# EAGLE design anemo4 (EAGLE 6.6.0)
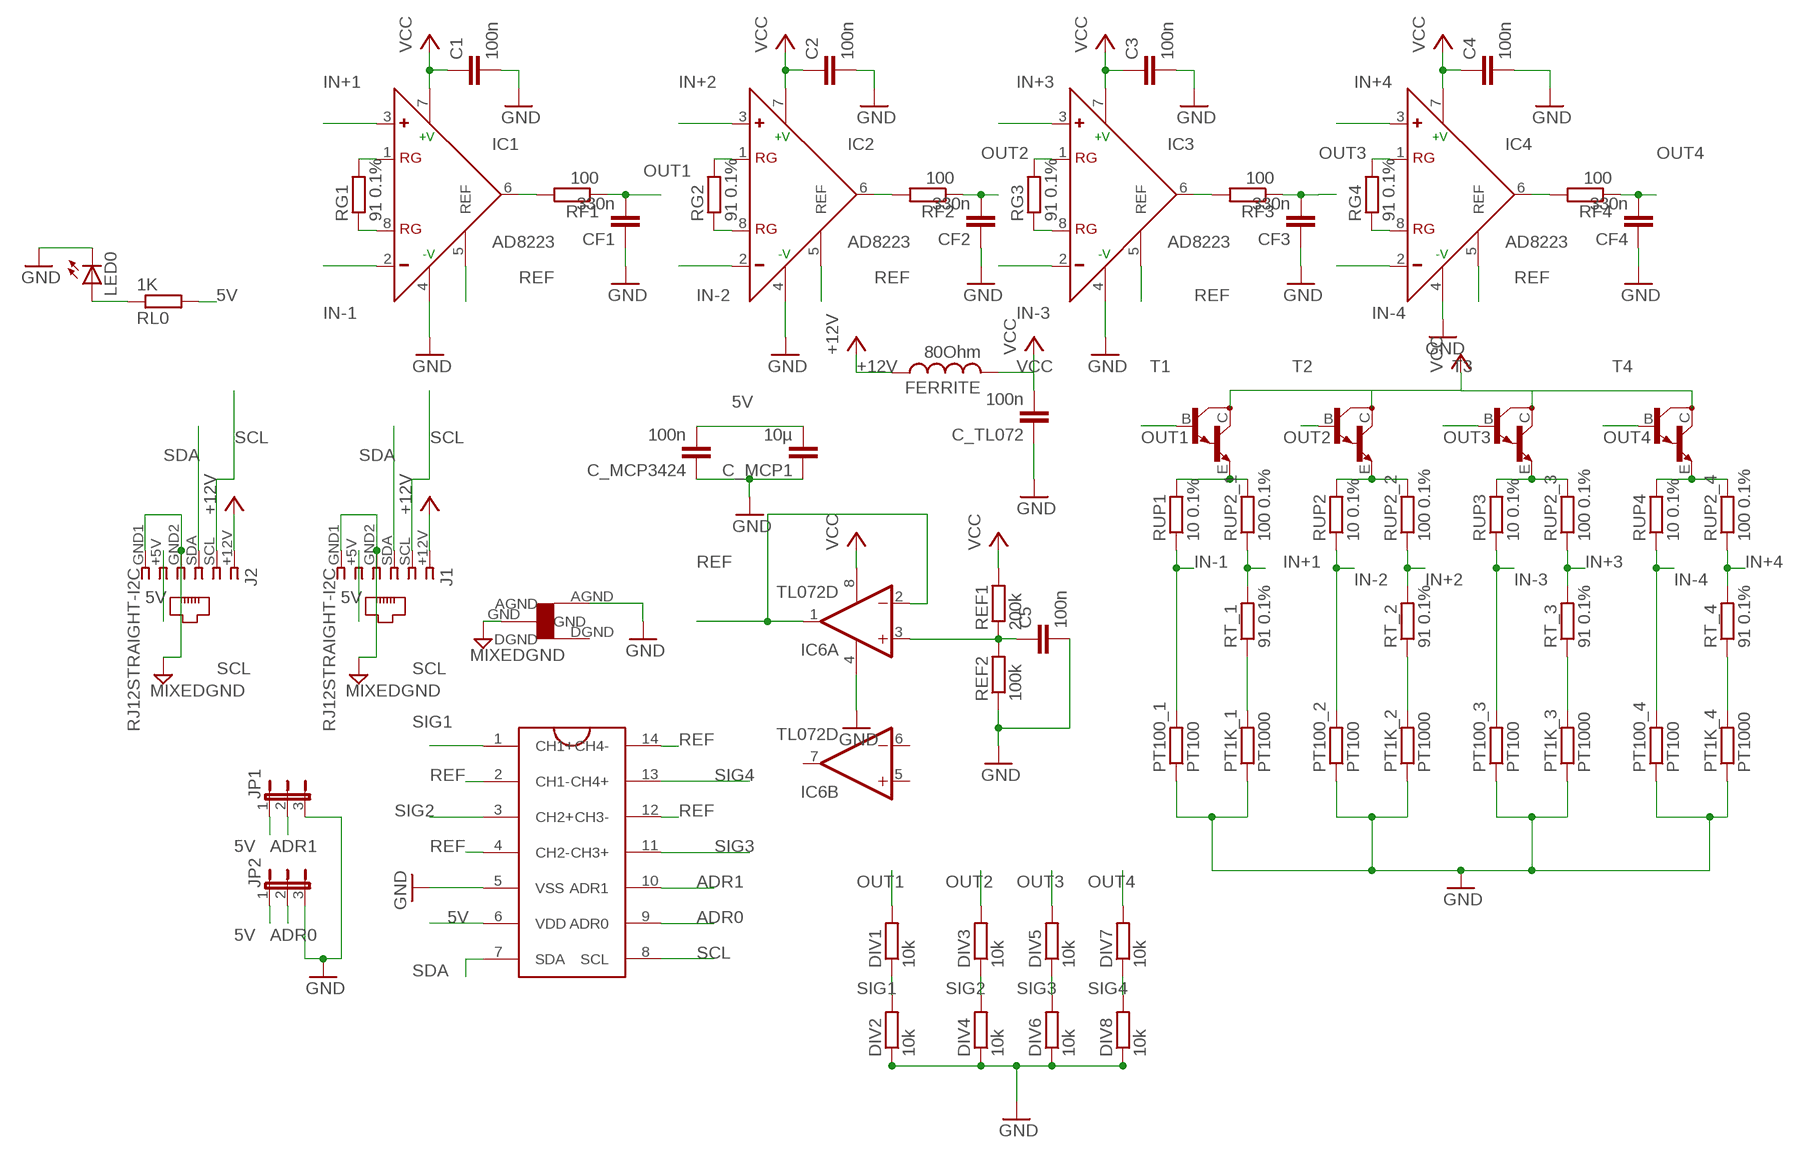
[diagram p0: schematic, sheet 1]

## Parts
C1  100n  C-EUC1206  [C1206]
C2  100n  C-EUC1206  [C1206]
C3  100n  C-EUC1206  [C1206]
C4  100n  C-EUC1206  [C1206]
C5  100n  C-EUC1206  [C1206]
C_MCP1  10µ  C-EUC1206  [C1206]
C_MCP3424  100n  C-EUC1206  [C1206]
C_TL072  100n  C-EUC1206  [C1206]
CF1  330n  C-EUC1206  [C1206]
CF2  330n  C-EUC1206  [C1206]
CF3  330n  C-EUC1206  [C1206]
CF4  330n  C-EUC1206  [C1206]
DIV1  10k  R-EU_M1206  [M1206]
DIV2  10k  R-EU_M1206  [M1206]
DIV3  10k  R-EU_M1206  [M1206]
DIV4  10k  R-EU_M1206  [M1206]
DIV5  10k  R-EU_M1206  [M1206]
DIV6  10k  R-EU_M1206  [M1206]
DIV7  10k  R-EU_M1206  [M1206]
DIV8  10k  R-EU_M1206  [M1206]
FERRITE  80Ohm  L-USL3216C  [L3216C]
IC1  AD8223  AD620R  [SO8]
IC2  AD8223  AD620R  [SO8]
IC3  AD8223  AD620R  [SO8]
IC4  AD8223  AD620R  [SO8]
IC6  TL072D  [SO08]
J1  RJ12STRAIGHT-I2C  [RJ12-STRAIGHT-I2C]
J2  RJ12STRAIGHT-I2C  [RJ12-STRAIGHT-I2C]
JP1  JP2E  [JP2]
JP2  JP2E  [JP2]
LED0  LED1206  [LED-1206]
PT1K_1  PT1000  R-EU_M1206  [M1206]
PT1K_2  PT1000  R-EU_M1206  [M1206]
PT1K_3  PT1000  R-EU_M1206  [M1206]
PT1K_4  PT1000  R-EU_M1206  [M1206]
PT100_1  PT100  R-EU_M1206  [M1206]
PT100_2  PT100  R-EU_M1206  [M1206]
PT100_3  PT100  R-EU_M1206  [M1206]
PT100_4  PT100  R-EU_M1206  [M1206]
REF1  200k  R-EU_M1206  [M1206]
REF2  100k  R-EU_M1206  [M1206]
RF1  100  R-EU_M1206  [M1206]
RF2  100  R-EU_M1206  [M1206]
RF3  100  R-EU_M1206  [M1206]
RF4  100  R-EU_M1206  [M1206]
RG1  91 0.1%  R-EU_M1206  [M1206]
RG2  91 0.1%  R-EU_M1206  [M1206]
RG3  91 0.1%  R-EU_M1206  [M1206]
RG4  91 0.1%  R-EU_M1206  [M1206]
RL0  1K  R-EU_M1206  [M1206]
RT_1  91 0.1%  R-EU_M1206  [M1206]
RT_2  91 0.1%  R-EU_M1206  [M1206]
RT_3  91 0.1%  R-EU_M1206  [M1206]
RT_4  91 0.1%  R-EU_M1206  [M1206]
RUP1  10 0.1%  R-EU_M1206  [M1206]
RUP2  10 0.1%  R-EU_M1206  [M1206]
RUP2_1  100 0.1%  R-EU_M1206  [M1206]
RUP2_2  100 0.1%  R-EU_M1206  [M1206]
RUP2_3  100 0.1%  R-EU_M1206  [M1206]
RUP2_4  100 0.1%  R-EU_M1206  [M1206]
RUP3  10 0.1%  R-EU_M1206  [M1206]
RUP4  10 0.1%  R-EU_M1206  [M1206]
T1  MMBTA13LT1-NPN_DARL-SOT23-BEC  [SOT23-BEC]
T2  MMBTA13LT1-NPN_DARL-SOT23-BEC  [SOT23-BEC]
T3  MMBTA13LT1-NPN_DARL-SOT23-BEC  [SOT23-BEC]
T4  MMBTA13LT1-NPN_DARL-SOT23-BEC  [SOT23-BEC]
U$1  MCP3424(SO14)  [14LDSOIC]
U$2  STARGND  [STAR]

## Nets
5V: C_MCP1.2 C_MCP3424.2 J1.+5V J2.+5V JP1.1 JP2.1 RL0.2 U$1.6(VDD)
+12V: FERRITE.1 J1.+12V J2.+12V
ADR0: JP2.2 U$1.9(ADR0)
ADR1: JP1.2 U$1.10(ADR1)
GND [gnd]: C1.2 C2.2 C3.2 C4.2 C5.2 C_MCP1.1 C_MCP3424.1 C_TL072.1 CF1.1 CF2.1 CF3.1 CF4.1 DIV2.1 DIV4.1 DIV6.1 DIV8.1 IC1.4(-V) IC2.4(-V) IC3.4(-V) IC4.4(-V) IC6.4(P:V-) JP1.3 JP2.3 LED0.C PT1K_1.1 PT1K_2.1 PT1K_3.1 PT1K_4.1 PT100_1.1 PT100_2.1 PT100_3.1 PT100_4.1 REF2.1 U$1.5(VSS) U$2.AGND
IN+1: IC1.3(+) RT_1.2 RUP2_1.1
IN+2: IC2.3(+) RT_2.2 RUP2_2.1
IN+3: IC3.3(+) RT_3.2 RUP2_3.1
IN+4: IC4.3(+) RT_4.2 RUP2_4.1
IN-1: IC1.2(-) PT100_1.2 RUP1.1
IN-2: IC2.2(-) PT100_2.2 RUP2.1
IN-3: IC3.2(-) PT100_3.2 RUP3.1
IN-4: IC4.2(-) PT100_4.2 RUP4.1
MIXEDGND [gnd]: J1.GND1 J1.GND2 J2.GND1 J2.GND2 U$2.GND
N$1: IC1.1(RG) RG1.2
N$2: IC1.8(RG) RG1.1
N$3: IC2.8(RG) RG2.1
N$4: IC2.1(RG) RG2.2
N$5: IC3.1(RG) RG3.2
N$6: IC3.8(RG) RG3.1
N$7: IC4.1(RG) RG4.2
N$8: IC4.8(RG) RG4.1
N$9: RUP1.2 RUP2_1.2 T1.E
N$10: C5.1 IC6.3(A:+IN) REF1.1 REF2.2
N$11: RUP2.2 RUP2_2.2 T2.E
N$12: RUP2_3.2 RUP3.2 T3.E
N$13: RUP2_4.2 RUP4.2 T4.E
N$14: LED0.A RL0.1
N$18: IC1.6(OUT) RF1.2
N$19: IC2.6(OUT) RF2.2
N$20: IC3.6(OUT) RF3.2
N$21: IC4.6(OUT) RF4.2
N$23: PT1K_1.2 RT_1.1
N$25: PT1K_2.2 RT_2.1
N$27: PT1K_3.2 RT_3.1
N$29: PT1K_4.2 RT_4.1
OUT1: CF1.2 DIV1.2 RF1.1 T1.B
OUT2: CF2.2 DIV3.2 RF2.1 T2.B
OUT3: CF3.2 DIV5.2 RF3.1 T3.B
OUT4: CF4.2 DIV7.2 RF4.1 T4.B
REF: IC1.5(REF) IC2.5(REF) IC3.5(REF) IC4.5(REF) IC6.1(A:OUT) IC6.2(A:-IN) U$1.2(CH1-) U$1.4(CH2-) U$1.12(CH3-) U$1.14(CH4-)
SCL: J1.SCL J2.SCL U$1.8(SCL)
SDA: J1.SDA J2.SDA U$1.7(SDA)
SIG1: DIV1.1 DIV2.2 U$1.1(CH1+)
SIG2: DIV3.1 DIV4.2 U$1.3(CH2+)
SIG3: DIV5.1 DIV6.2 U$1.11(CH3+)
SIG4: DIV7.1 DIV8.2 U$1.13(CH4+)
VCC [highpower]: C1.1 C2.1 C3.1 C4.1 C_TL072.2 FERRITE.2 IC1.7(+V) IC2.7(+V) IC3.7(+V) IC4.7(+V) IC6.8(P:V+) REF1.2 T1.C T2.C T3.C T4.C
Unconnected: IC6.5(B:+IN) IC6.6(B:-IN) IC6.7(B:OUT) U$2.DGND

## Library data of the parts
C1-C5 C_MCP1 C_MCP3424 C_TL072 CF1-CF4 = rcl:C-EU: CAPACITOR, European symbol
DIV1-DIV8 PT1K_1-PT1K_4 PT100_1-PT100_4 REF1 REF2 RF1-RF4 RG1-RG4 RL0 RT_1-RT_4 RUP1 RUP2 RUP2_1-RUP2_4 RUP3 RUP4 = resistor:R-EU_: RESISTOR, European symbol
FERRITE = rcl:L-US: INDUCTOR, American symbol
IC1-IC4 = analog-devices:AD620: Low Cost, Low Power, Instrumentation Amplifier Source: http://www.analog.com/UploadedFiles/Data_Sheets/37793330023930AD620_e.pdf; MPN: AD620AR; OC_FARNELL: 1464424; OC_NEWARK: 05F7109
IC6 = linear:TL072: OP AMP
J1 J2 = lpatiny:RJ12: CORCOM Modular RJ Jacks No Shield Source: www.tycoelectronics.com .. ENG_DS_1654001_1099_RJ_L_0507.pdf
JP1 JP2 = jumper:JP2E: JUMPER
LED0 = SparkFun:LED: LEDs Standard schematic elements and footprints for 5mm, 3mm, 1206, and 0603 sized LEDs. 5mm - Spark Fun Electronics SKU : COM-00529 (and others)
T1-T4 = transistor:*-NPN_DARL-: NPN Darlington Transistor
U$1 = mcp3424:MCP3424(SO14)
U$2 = lpatiny:STARGND

## Net classes
0 default: width 0.61 mm
1 gnd: width 0.61 mm
2 highpower: width 0.813 mm

## Board
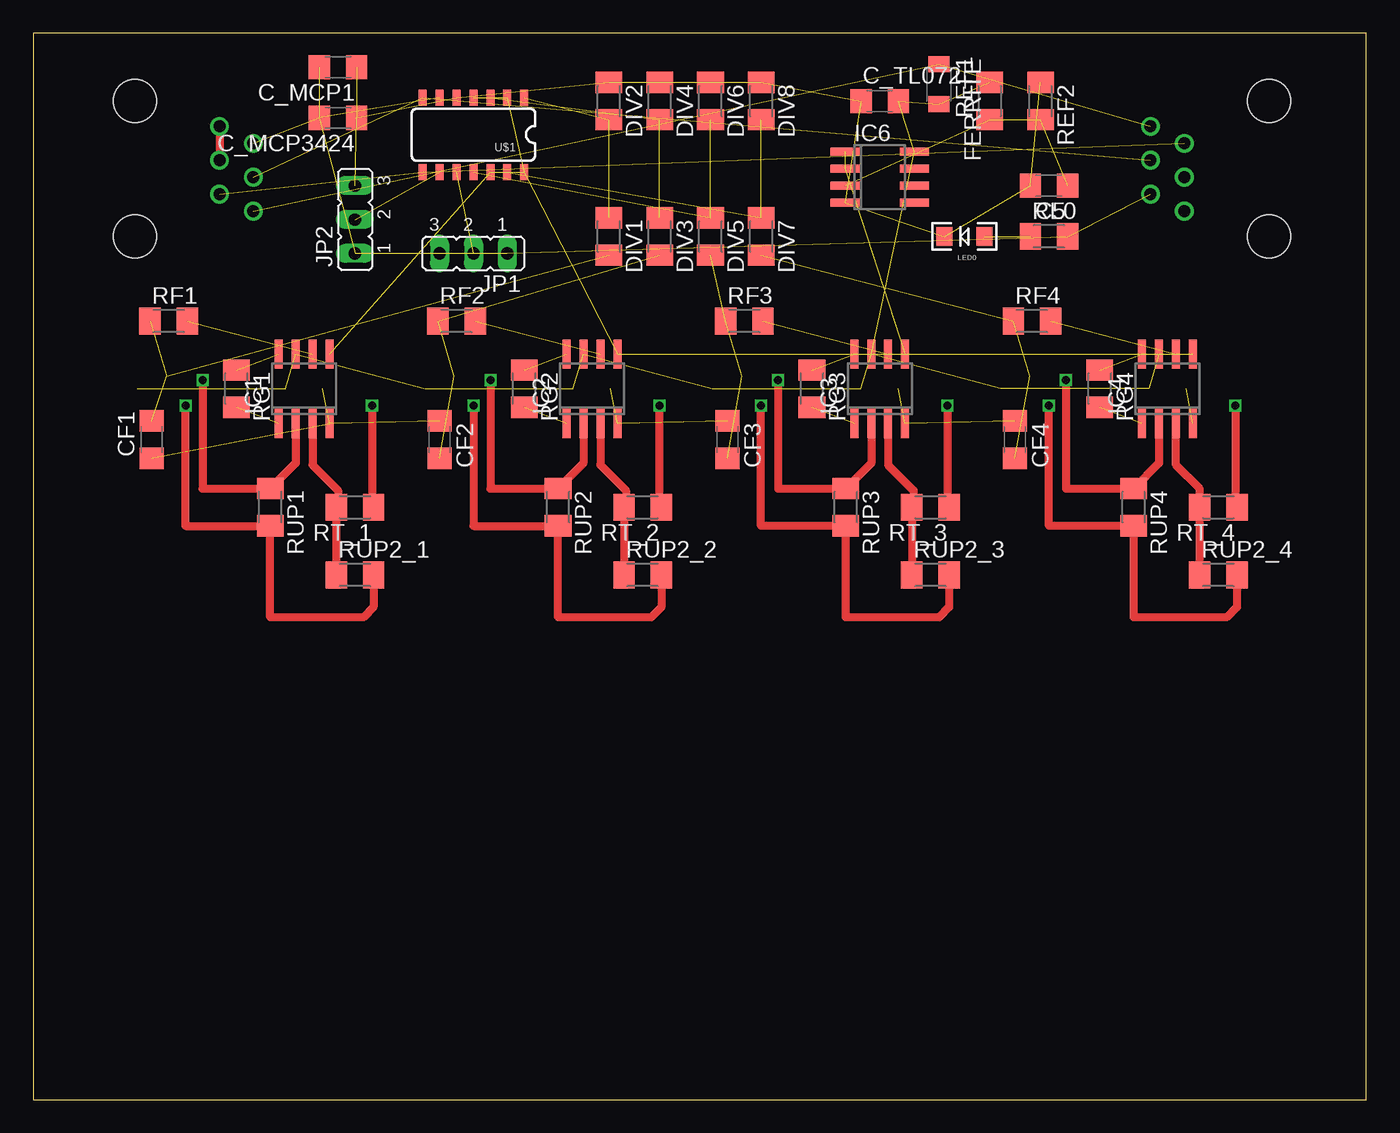
[diagram p1: board, top side]
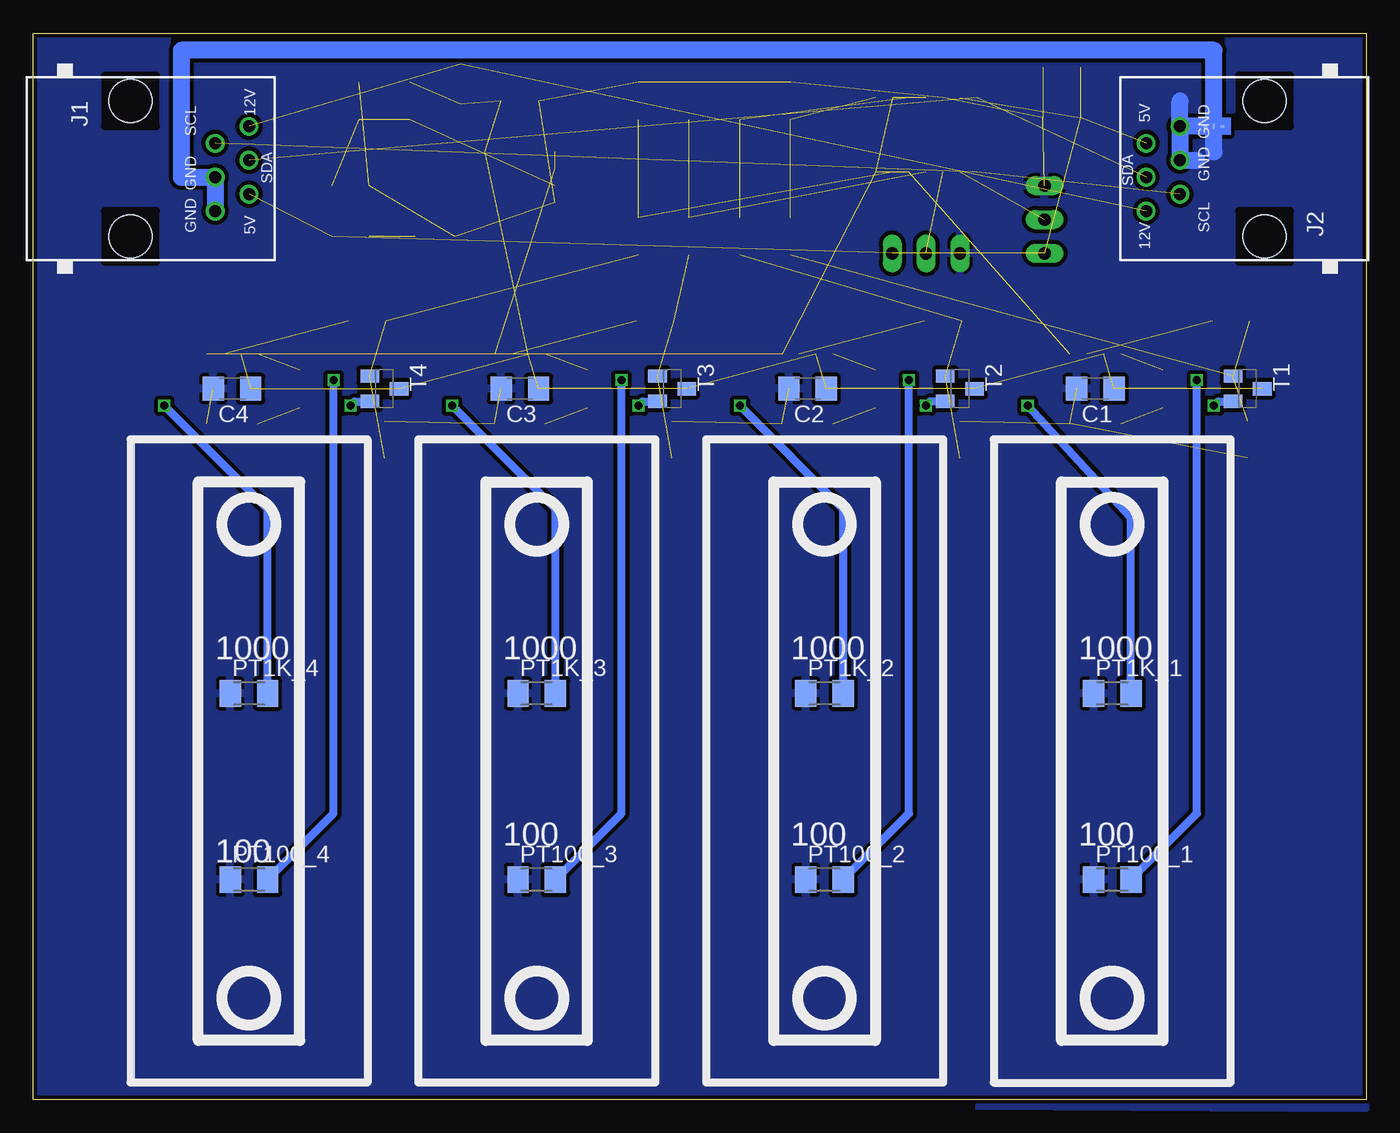
[diagram p2: board, bottom side, seen from below]

Size 100 x 80 mm. Coordinates in mm from the lower left corner, seen from the top.
Outline: 0,0 100,0 100,80 0,80 0,0
Copper layers (1*16): Top 0.035mm / dielectric 1.5mm / Bottom 0.035mm
Design rules "Fusion_eagle_rule_v1.1": minimum track width 6mil, minimum drill 12mil, track to track 6mil, track to pad 6mil, pad to pad 6mil, via to via 6mil, smd to smd 0mil, copper to edge 10mil, drill to drill 10mil, minimum pad ring 10mil, minimum via ring 6mil, stop-mask expansion 2mil, vias tented up to drill 100mil, thermal gap 10mil
vRestrict: area -2.5,-1.3 to 102.9,50.8

### Footprints (pad centres in the part's own frame; a part is rotated, then mirrored left to right if it is on the bottom)
C1206 = smd 1.6 x 1.8: 1 -1.4,0; 2 1.4,0
M1206 = smd 1.6 x 2: 1 -1.4,0; 2 1.4,0
L3216C = smd 1.2 x 1.6: 1 -1.5,0; 2 1.5,0
SO8 = smd 0.6 x 2.2: 1 -1.905,-2.6; 2 -0.635,-2.6; 3 0.635,-2.6; 4 1.905,-2.6; 5 1.905,2.6; 6 0.635,2.6; 7 -0.635,2.6; 8 -1.905,2.6
SO08 = smd 0.6 x 2.2: 1 -1.905,-2.6; 2 -0.635,-2.6; 3 0.635,-2.6; 4 1.905,-2.6; 5 1.905,2.6; 6 0.635,2.6; 7 -0.635,2.6; 8 -1.905,2.6
RJ12-STRAIGHT-I2C = drill 0.9 pad 1.4: +5V 1.905,8.89; +12V -3.175,8.89; GND1 3.175,6.35; GND2 0.635,6.35; SCL -1.905,6.35; SDA -0.635,8.89 | hole 3.251: -5.08,0; 5.08,0
JP2 = drill 0.914 long: 1 -2.54,0; 2 0,0; 3 2.54,0
LED-1206 = smd 1.2 x 1.4: A -1.5,0; C 1.5,0
SOT23-BEC = smd 1 x 1.4: B -0.95,-1.1; C 0,1.1; E 0.95,-1.1
14LDSOIC = smd 1.2 x 0.6: 1 -2.8,3.81; 2 -2.8,2.54; 3 -2.8,1.27; 4 -2.8,0; 5 -2.8,-1.27; 6 -2.8,-2.54; 7 -2.8,-3.81; 8 2.8,-3.81; 9 2.8,-2.54; 10 2.8,-1.27; 11 2.8,0; 12 2.8,1.27; 13 2.8,2.54; 14 2.8,3.81
STAR = smd 0.152 x 0.305: AGND 0.635,-0.635; DGND 0.635,0.635 | smd 0.305 x 0.152: GND 0.635,0

### Placement (x,y rotation side)
C1  20.32,53.34 180 bottom
C2  41.91,53.34 180 bottom
C3  63.5,53.34 180 bottom
C4  85.09,53.34 180 bottom
C5  76.2,68.58 180 top
C_MCP1  22.86,77.47 180 top
C_MCP3424  22.86,73.66 180 top
C_TL072  63.5,74.93 0 top
CF1  8.89,49.53 90 top
CF2  30.48,49.53 270 top
CF3  52.07,49.53 270 top
CF4  73.66,49.53 270 top
DIV1  43.18,64.77 270 top
DIV2  43.18,74.93 270 top
DIV3  46.99,64.77 270 top
DIV4  46.99,74.93 270 top
DIV5  50.8,64.77 270 top
DIV6  50.8,74.93 270 top
DIV7  54.61,64.77 270 top
DIV8  54.61,74.93 270 top
FERRITE  67.94,76.2 270 top
IC1  20.32,53.34 0 top
IC2  41.91,53.34 0 top
IC3  63.5,53.34 0 top
IC4  85.09,53.34 0 top
IC6  63.5,69.22 270 top
J1  92.71,69.85 270 bottom
J2  7.62,69.85 90 bottom
JP1  33.02,63.5 180 top
JP2  24.13,66.04 90 top
LED0  69.85,64.77 180 top
PT1K_1  19.05,30.48 0 bottom
PT1K_2  40.64,30.48 0 bottom
PT1K_3  62.23,30.48 0 bottom
PT1K_4  83.82,30.48 0 bottom
PT100_1  19.05,16.51 0 bottom
PT100_2  40.64,16.51 0 bottom
PT100_3  62.23,16.51 0 bottom
PT100_4  83.82,16.51 0 bottom
REF1  71.75,74.93 90 top
REF2  75.56,74.93 270 top
RF1  10.16,58.42 0 top
RF2  31.75,58.42 0 top
RF3  53.34,58.42 0 top
RF4  74.93,58.42 0 top
RG1  15.24,53.34 270 top
RG2  36.83,53.34 270 top
RG3  58.42,53.34 270 top
RG4  80.01,53.34 270 top
RL0  76.2,64.77 0 top
RT_1  24.13,44.45 180 top
RT_2  45.72,44.45 180 top
RT_3  67.31,44.45 180 top
RT_4  88.9,44.45 180 top
RUP1  17.78,44.45 270 top
RUP2  39.37,44.45 270 top
RUP2_1  24.13,39.37 0 top
RUP2_2  45.72,39.37 0 top
RUP2_3  67.31,39.37 0 top
RUP2_4  88.9,39.37 0 top
RUP3  60.96,44.45 270 top
RUP4  82.55,44.45 270 top
T1  8.89,53.34 270 bottom
T2  30.48,53.34 270 bottom
T3  52.07,53.34 270 bottom
T4  73.66,53.34 270 bottom
U$1  33.02,72.39 270 top
U$2  11.43,73.66 270 bottom

### Tracks (layer width: path | path; a pad name or v marks a point on that pad's centre or on a via)
5V  (7 unrouted)
+12V  (2 unrouted)
ADR0  (1 unrouted)
ADR1  (1 unrouted)
GND  (20 unrouted)
  Bottom 1.27: 11.43,71.12 11.43,73.03 U$2.AGND 13.97,73.03 | 13.97,73.03 13.97,74.93 | 13.97,73.03 13.97,70.48 12.7,70.48
  pour Bottom (isolate 0.305): 0,80.01 99.69,80.01 99.69,0 0,-0.64
IN+1
  Top 0.61: IC1.3 20.95,47.62 22.86,45.72 22.86,44.58 RT_1.2 RUP2_1.1
IN+2
  Top 0.61: IC2.3 42.55,47.62 44.45,45.72 44.45,44.58 RT_2.2 RUP2_2.1
IN+3
  Top 0.61: IC3.3 64.14,47.62 66.04,45.72 66.04,44.58 RT_3.2 RUP2_3.1
IN+4
  Top 0.61: RUP2_4.1 RT_4.2 87.5,45.85 85.72,47.62 IC4.3
IN-1  (via drill 0.6)
  Top 0.61: IC1.2 19.68,47.76 RUP1.1 12.7,45.85 v12.7,53.98
  Bottom 0.61: PT100_1.2 12.7,21.46 v12.7,53.98
IN-2  (via drill 0.6)
  Top 0.61: IC2.2 41.27,47.76 RUP2.1 34.29,45.85 v34.29,53.98
  Bottom 0.61: PT100_2.2 34.29,21.46 v34.29,53.98
IN-3  (via drill 0.6)
  Top 0.61: v55.88,53.98 55.88,45.85 RUP3.1 62.87,47.76 IC3.2
  Bottom 0.61: PT100_3.2 55.88,21.46 v55.88,53.98
IN-4  (via drill 0.6)
  Top 0.61: v77.47,53.98 77.47,45.85 RUP4.1 84.45,47.76 IC4.2
  Bottom 0.61: PT100_4.2 77.47,21.46 v77.47,53.98
MIXEDGND
  Top 0.61: J2.GND1 J2.GND2
  Bottom 1.27: J1.GND1 J1.GND2 88.9,69.22 88.9,78.74 11.43,78.74 U$2.GND J2.GND1 J2.GND2
N$1  (1 unrouted)
N$2  (1 unrouted)
N$3  (1 unrouted)
N$4  (1 unrouted)
N$5  (1 unrouted)
N$6  (1 unrouted)
N$7  (1 unrouted)
N$8  (1 unrouted)
N$9  (via drill 0.6)
  Top 0.61: RUP2_1.2 25.53,36.96 24.77,36.2 17.78,36.2 RUP1.2 11.43,43.05 v11.43,52.07
  Bottom 0.61: v11.43,52.07 11.11,52.39 T1.E
N$10  (3 unrouted)
N$11  (via drill 0.6)
  Top 0.61: RUP2_2.2 47.12,36.96 46.35,36.2 39.37,36.2 RUP2.2 33.02,43.05 v33.02,52.07
  Bottom 0.61: T2.E 32.7,52.39 v33.02,52.07
N$12  (via drill 0.6)
  Top 0.61: v54.61,52.07 54.61,43.05 RUP3.2 60.96,36.2 67.94,36.2 68.71,36.96 RUP2_3.2
  Bottom 0.61: v54.61,52.07 54.29,52.39 T3.E
N$13  (via drill 0.6)
  Top 0.61: v76.2,52.07 76.2,43.05 RUP4.2 82.55,36.2 89.53,36.2 90.3,36.96 RUP2_4.2
  Bottom 0.61: v76.2,52.07 75.88,52.39 T4.E
N$14  (1 unrouted)
N$18  (1 unrouted)
N$19  (1 unrouted)
N$20  (1 unrouted)
N$21  (1 unrouted)
N$23  (via drill 0.6)
  Top 0.61: v25.4,52.07 25.4,44.95 RT_1.1
  Bottom 0.61: PT1K_1.2 17.65,43.69 v25.4,52.07
N$25  (via drill 0.6)
  Top 0.61: RT_2.1 46.99,44.45 v46.99,52.07
  Bottom 0.61: v46.99,52.07 39.24,44.32 PT1K_2.2
N$27  (via drill 0.6)
  Top 0.61: v68.58,52.07 68.58,44.58 RT_3.1
  Bottom 0.61: PT1K_3.2 60.83,44.32 v68.58,52.07
N$29  (via drill 0.6)
  Top 0.61: v90.17,52.07 90.17,44.58 RT_4.1
  Bottom 0.61: PT1K_4.2 82.42,44.32 v90.17,52.07
OUT1  (3 unrouted)
OUT2  (3 unrouted)
OUT3  (3 unrouted)
OUT4  (3 unrouted)
REF  (9 unrouted)
SCL  (2 unrouted)
SDA  (2 unrouted)
SIG1  (2 unrouted)
SIG2  (2 unrouted)
SIG3  (2 unrouted)
SIG4  (2 unrouted)
VCC  (15 unrouted)

### Text on the board
_bsilk: 1000 | 1000 | 1000 | 1000 | 100 | 100 | 100 | 100